# EAGLE design Otemba (EAGLE 5.11)
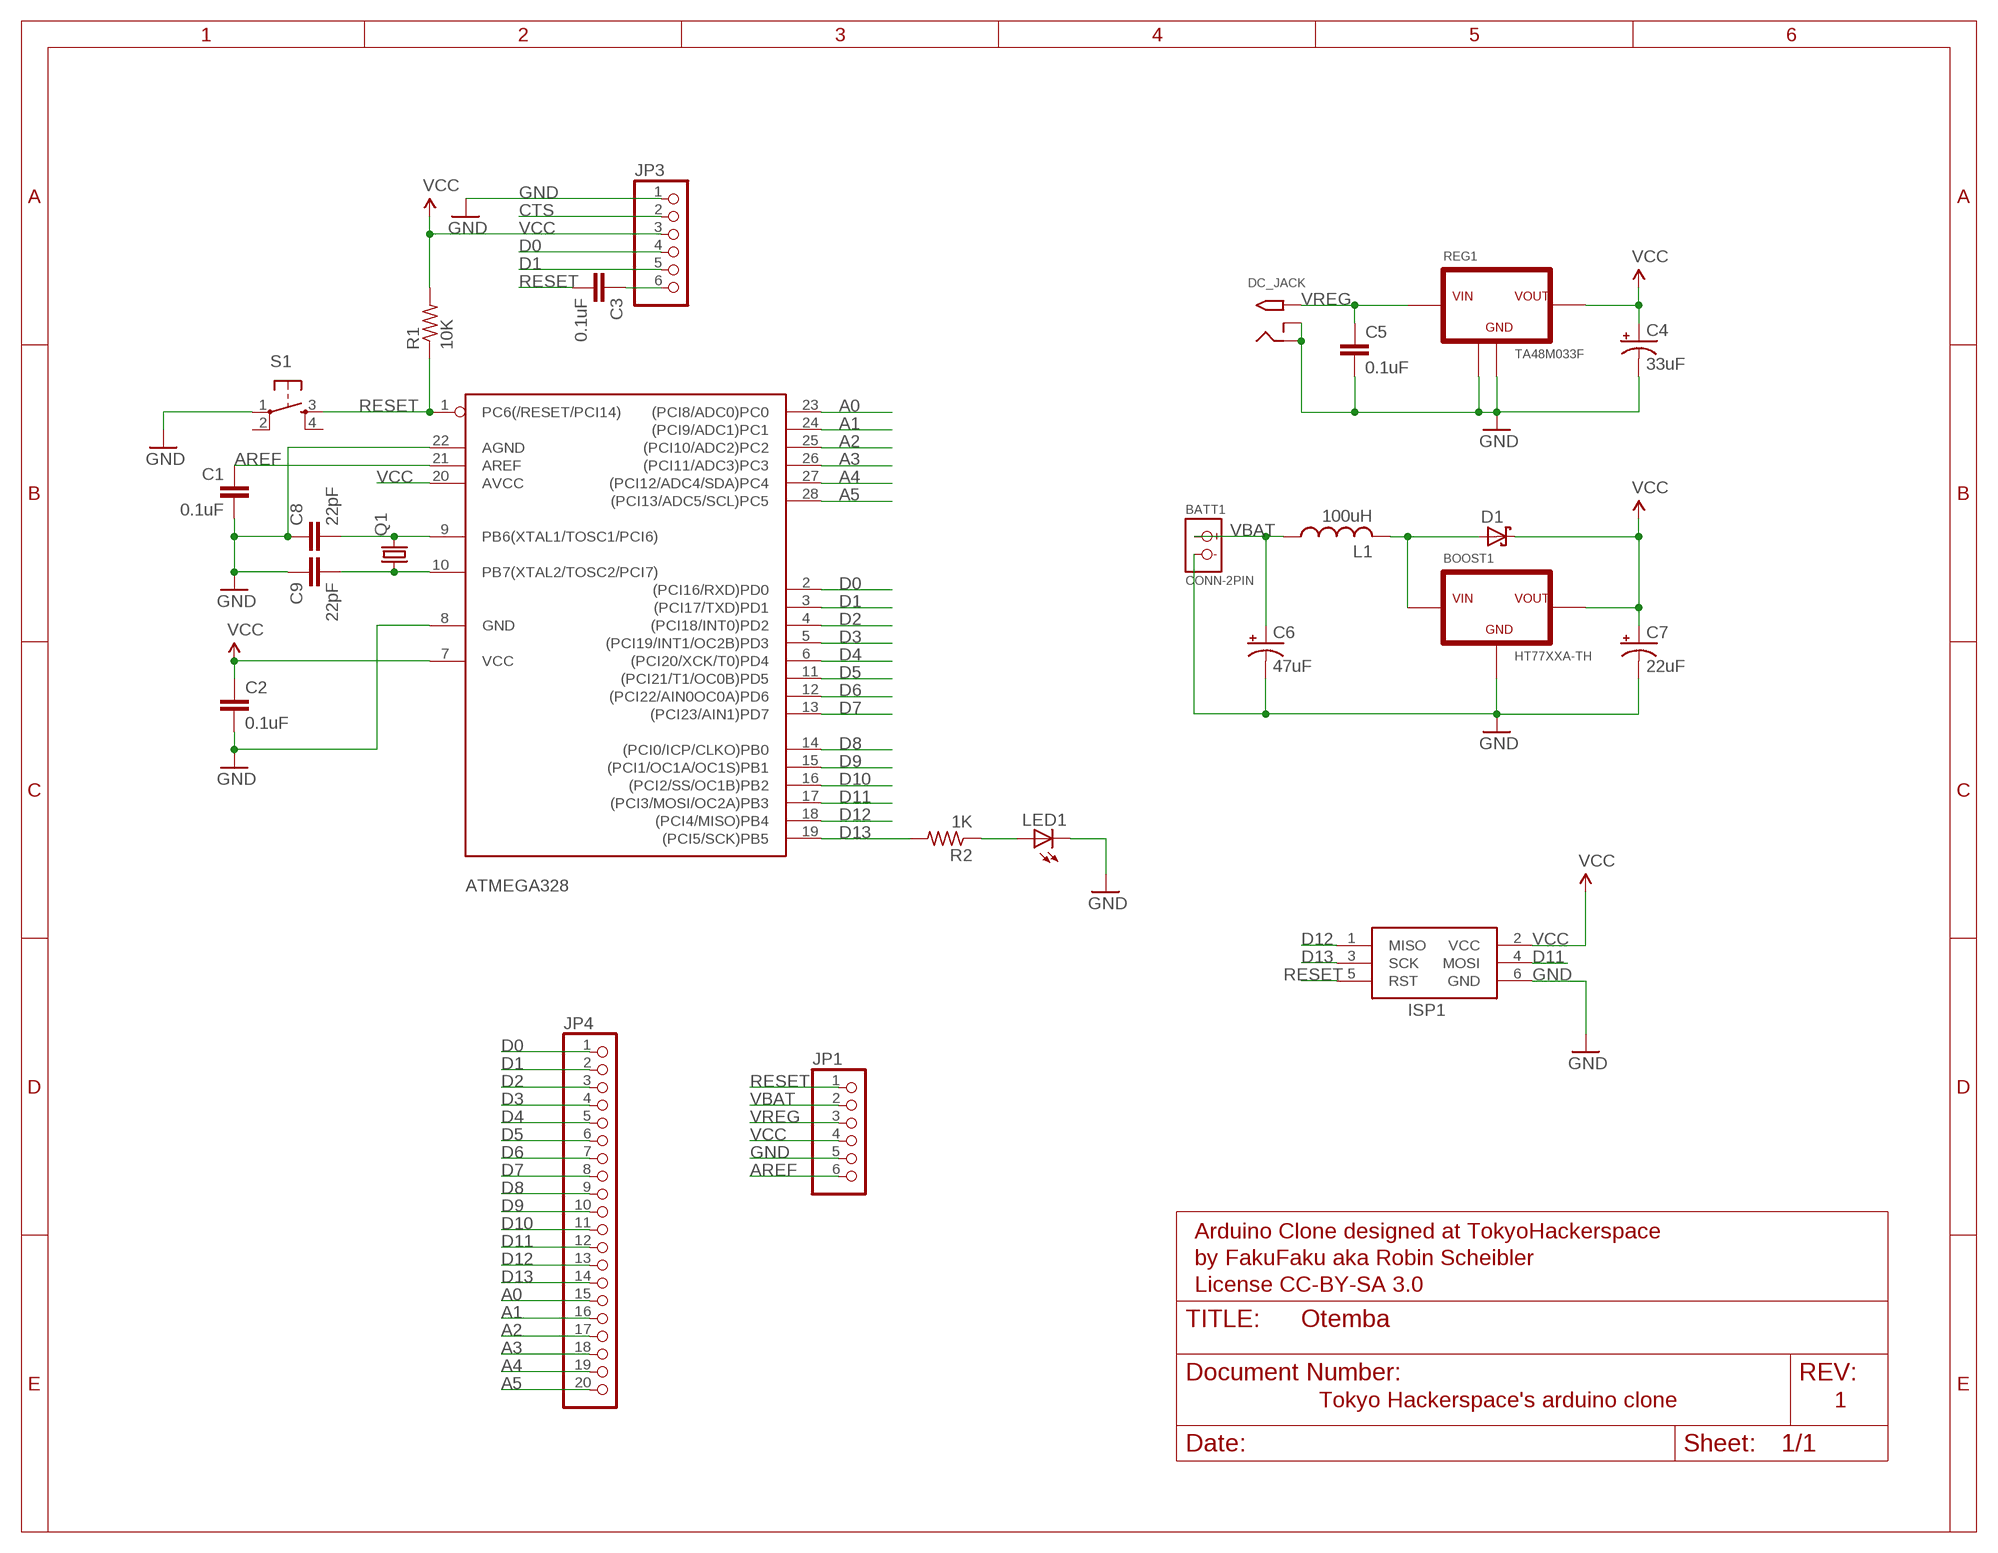
[diagram p0: schematic, sheet 1]

## Parts
ATMEGA328  ATMEGA168-20P  [DIL28-3]
BATT1  CONN-2PIN  [JST-XH2P]
BOOST1  HT77XXA-TH  [TO92-]
C1  0.1uF  CAPPTH  [CAP-PTH-SMALL]
C2  0.1uF  CAPPTH  [CAP-PTH-SMALL]
C3  0.1uF  CAPPTH  [CAP-PTH-SMALL]
C4  33uF  CPOL-USE2-5  [E2-5]
C5  0.1uF  CAPPTH  [CAP-PTH-SMALL]
C6  47uF  CPOL-USE2-5  [E2-5]
C7  22uF  CPOL-USE2-5  [E2-5]
C8  22pF  CAPPTH  [CAP-PTH-SMALL]
C9  22pF  CAPPTH  [CAP-PTH-SMALL]
D1  SCHOTTKY-DIODEDO41-7  [DO41-7]
DC_JACK  2.1MMJACKTHM  [PJ-102A]
ISP1  AVRISP-6  [AVRISP]
JP1  PINHD-1X6  [1X06]
JP3  PINHD-1X6/90  [1X06/90]
JP4  PINHD-1X20  [1X20]
L1  100uH  L-US0207/10  [0207/10]
LED1  LED3MM  [LED3MM]
Q1  CRYSTALHC49S  [HC49/S]
R1  10K  R-US_0207/10  [0207/10]
R2  1K  R-US_0207/10  [0207/10]
REG1  TA48M033F  REGULATOR  [HSIP3-P-2.30B]
S1  TAC_SWITCHPTH  [TACTILE-PTH]

## Nets
A0: ATMEGA328.23((PCI8/ADC0)PC0) JP4.15
A1: ATMEGA328.24((PCI9/ADC1)PC1) JP4.16
A2: ATMEGA328.25((PCI10/ADC2)PC2) JP4.17
A3: ATMEGA328.26((PCI11/ADC3)PC3) JP4.18
A4: ATMEGA328.27((PCI12/ADC4/SDA)PC4) JP4.19
A5: ATMEGA328.28((PCI13/ADC5/SCL)PC5) JP4.20
AREF: ATMEGA328.21(AREF) C1.1 JP1.6
CTS: JP3.2
D0: ATMEGA328.2((PCI16/RXD)PD0) JP3.4 JP4.1
D1: ATMEGA328.3((PCI17/TXD)PD1) JP3.5 JP4.2
D2: ATMEGA328.4((PCI18/INT0)PD2) JP4.3
D3: ATMEGA328.5((PCI19/INT1/OC2B)PD3) JP4.4
D4: ATMEGA328.6((PCI20/XCK/T0)PD4) JP4.5
D5: ATMEGA328.11((PCI21/T1/OC0B)PD5) JP4.6
D6: ATMEGA328.12((PCI22/AIN0OC0A)PD6) JP4.7
D7: ATMEGA328.13((PCI23/AIN1)PD7) JP4.8
D8: ATMEGA328.14((PCI0/ICP/CLKO)PB0) JP4.9
D9: ATMEGA328.15((PCI1/OC1A/OC1S)PB1) JP4.10
D10: ATMEGA328.16((PCI2/SS/OC1B)PB2) JP4.11
D11: ATMEGA328.17((PCI3/MOSI/OC2A)PB3) ISP1.4(MOSI) JP4.12
D12: ATMEGA328.18((PCI4/MISO)PB4) ISP1.1(MISO) JP4.13
D13: ATMEGA328.19((PCI5/SCK)PB5) ISP1.3(SCK) JP4.14 R2.2
GND: ATMEGA328.8(GND) ATMEGA328.22(AGND) BATT1.M BOOST1.3(GND) C1.2 C2.2 C4.- C5.2 C6.- C7.- C8.1 C9.1 DC_JACK.RING DC_JACK.RING_SW ISP1.6(GND) JP1.5 JP3.1 LED1.K(C) REG1.2(GND) REG1.HEATSINK(GND) S1.1
N$1: ATMEGA328.9(PB6(XTAL1/TOSC1/PCI6)) C8.2 Q1.2
N$2: ATMEGA328.10(PB7(XTAL2/TOSC2/PCI7)) C9.2 Q1.1
N$4: BOOST1.1(VIN) D1.A L1.2
N$5: LED1.A R2.1
N$7: C3.1 JP3.6
RESET: ATMEGA328.1(PC6(/RESET/PCI14)) C3.2 ISP1.5(RST) JP1.1 R1.1 S1.3
VBAT: BATT1.P C6.+ JP1.2 L1.1
VCC: ATMEGA328.7(VCC) ATMEGA328.20(AVCC) BOOST1.2(VOUT) C2.1 C4.+ C7.+ D1.C ISP1.2(VCC) JP1.4 JP3.3 R1.2 REG1.3(VOUT)
VREG: C5.1 DC_JACK.TIP JP1.3 REG1.1(VIN)
Unconnected: S1.2 S1.4

## Notes on the sheet
- Arduino Clone designed at TokyoHackerspace
- by FakuFaku aka Robin Scheibler
- License CC-BY-SA 3.0
- Tokyo Hackerspace's arduino clone | 1

## Library data of the parts
ATMEGA328 = adafruit:ATMEGA168*P: MICROCONTROLLER 16 kBytes FLASH 1 kBytes SRAM 512 Bytes EEPROM USART 8-channel 10 bit ADC
BATT1 = Robin:CONN-2PIN
BOOST1 = Robin:HT77XXA-TH
C1-C3 C5 C8 C9 = SparkFun:CAP: Capacitor Standard 0603 ceramic capacitor, and 0.1" leaded capacitor.
C4 C6 C7 = adafruit:CPOL-US: POLARIZED CAPACITOR, American symbol
D1 = adafruit:SCHOTTKY-DIODE: Schottky Diode
DC_JACK = adafruit:2.1MMJACK: 2.1mm x 5.5mm THM DC jack with internal switch. Digikey part #PJ-102A, 4UCON part #05537 2.1mm x 5.5mm SMT DC jack with internal switch. Digikey part #PJ-002A-SMT, 4UCON part #03267 By microbuilder.eu & adafruit.com
ISP1 = adafruit:AVRISP: AVR ISP HEADER Standard 6 pin header for AVR programming
JP1 JP3 = pinhead:PINHD-1X6: PIN HEADER
JP4 = Robin:PINHD-1X20: PIN HEADER
L1 = rcl:L-US: INDUCTOR, American symbol
LED1 = adafruit:LED: LED OSRAM: - CHIPLED LG R971, LG N971, LY N971, LG Q971, LY Q971, LO R971, LY R971 LH N974, LH R974 LS Q976, LO Q976, LY Q976 LO Q996 - Hyper CHIPLED LW Q18S LB Q993, LB Q99A, LB R99A - SideLED LS A670, LO A670, LY A670, LG A670, LP A670 LB A673, LV A673, LT A673, LW A673 LH A674 LY A675 LS A676, LA A676, LO A676, LY A676, LW A676 LS A679, LY A679, LG A679 - Hyper Micro SIDELED® LS Y876, LA Y876, LO Y876, LY Y876 LT Y87S - SmartLED LW L88C, LW L88S LB L89C, LB L89S, LG L890 LS L89K, LO L89K, LY L89K LS L896, LA L896, LO L896, LY L896 - TOPLED LS T670, LO T670, LY T670, LG T670, LP T670 LSG T670, LSP T670, LSY T670, LOP T670, LYG T670 LG T671, LOG T671, LSG T671 LB T673, LV T673, LT T673, LW T673 LH T674 LS T676, LA T676, LO T676, LY T676, LB T676, LH T676, LSB T676, LW T676 LB T67C, LV T67C, LT T67C, LS T67K, LO T67K, LY T67K, LW E67C LS E67B, LA E67B, LO E67B, LY E67B, LB E67C, LV E67C, LT E67C LW T67C LS T679, LY T679, LG T679 LS T770, LO T770, LY T770, LG T770, LP T770 LB T773, LV T773, LT T773, LW T773 LH T774 LS E675, LA E675, LY E675, LS T675 LS T776, LA T776, LO T776, LY T776, LB T776 LHGB T686 LT T68C, LB T68C - Hyper Mini TOPLED® LB M676 - Mini TOPLED Santana® LG M470 LS M47K, LO M47K, LY M47K Source: http://www.osram.convergy.de/
Q1 = crystal:CRYSTAL: CRYSTAL; OC_FARNELL: 1667008; OC_NEWARK: unknown
R1 R2 = adafruit:R-US_: RESISTOR, American symbol
REG1 = Robin:REGULATOR
S1 = SparkFun:TAC_SWITCH: Momentary Switch Button commonly used for reset or general input. Spark Fun Electronics SKU : COM-00097

## Board
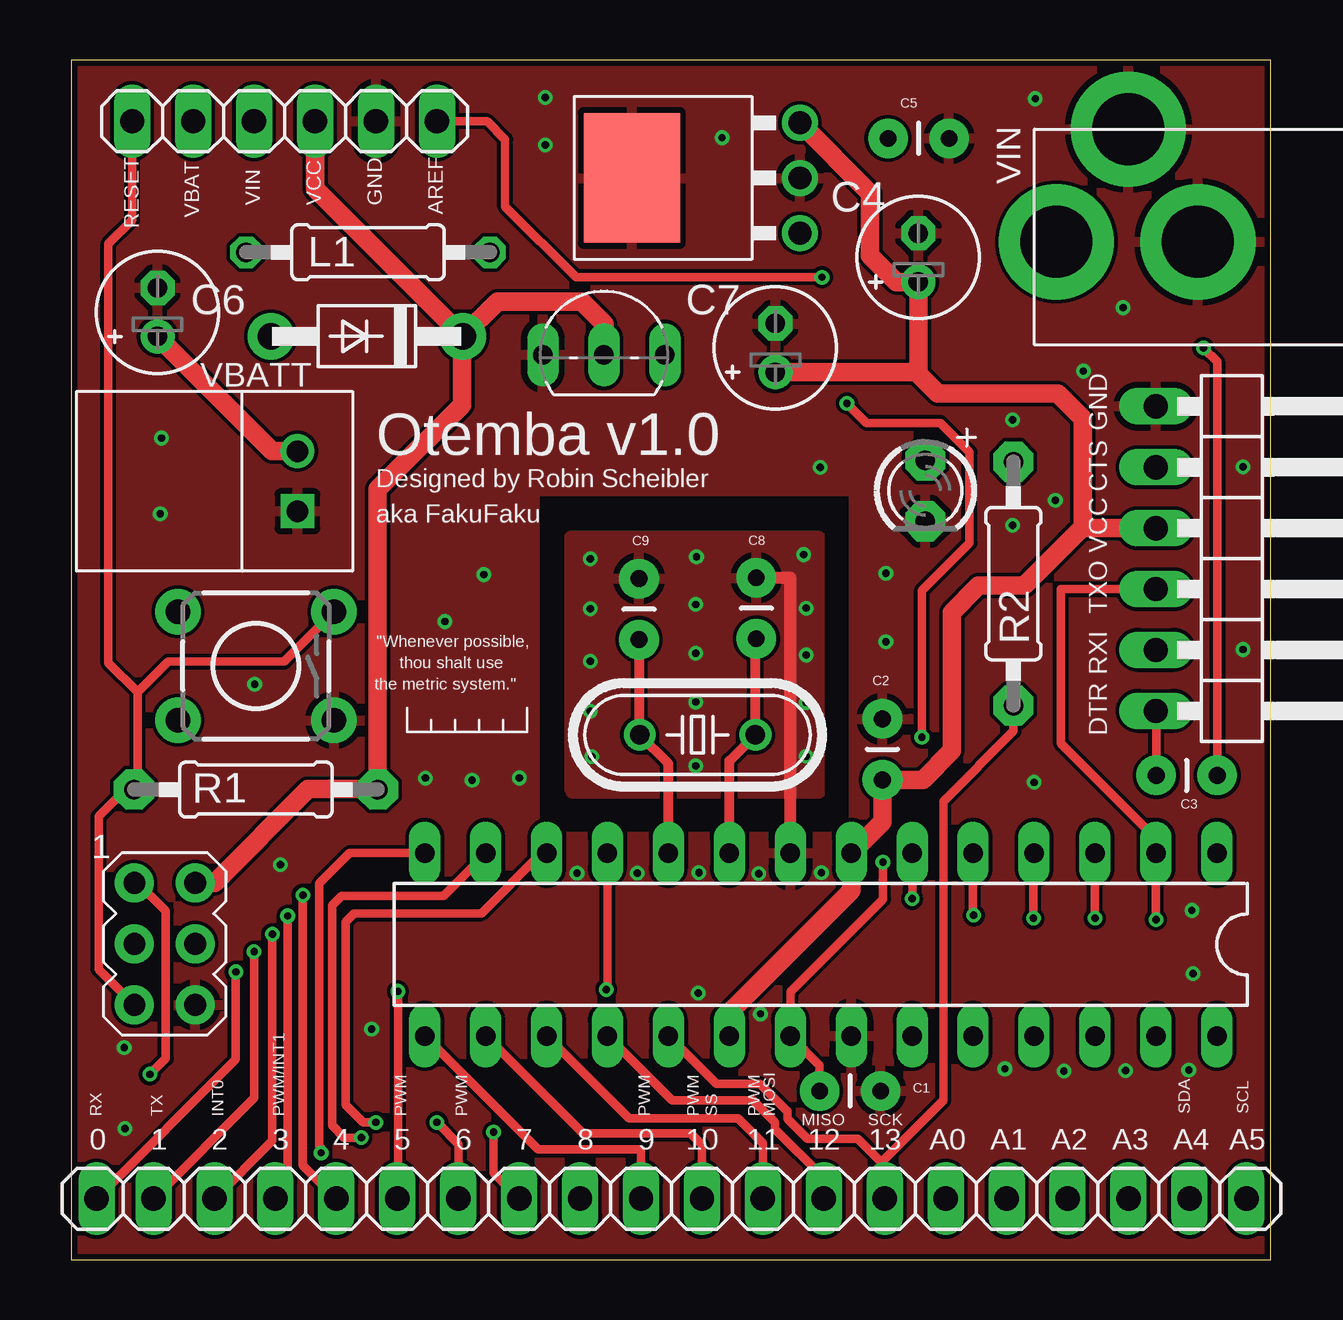
[diagram p1: board, top side]
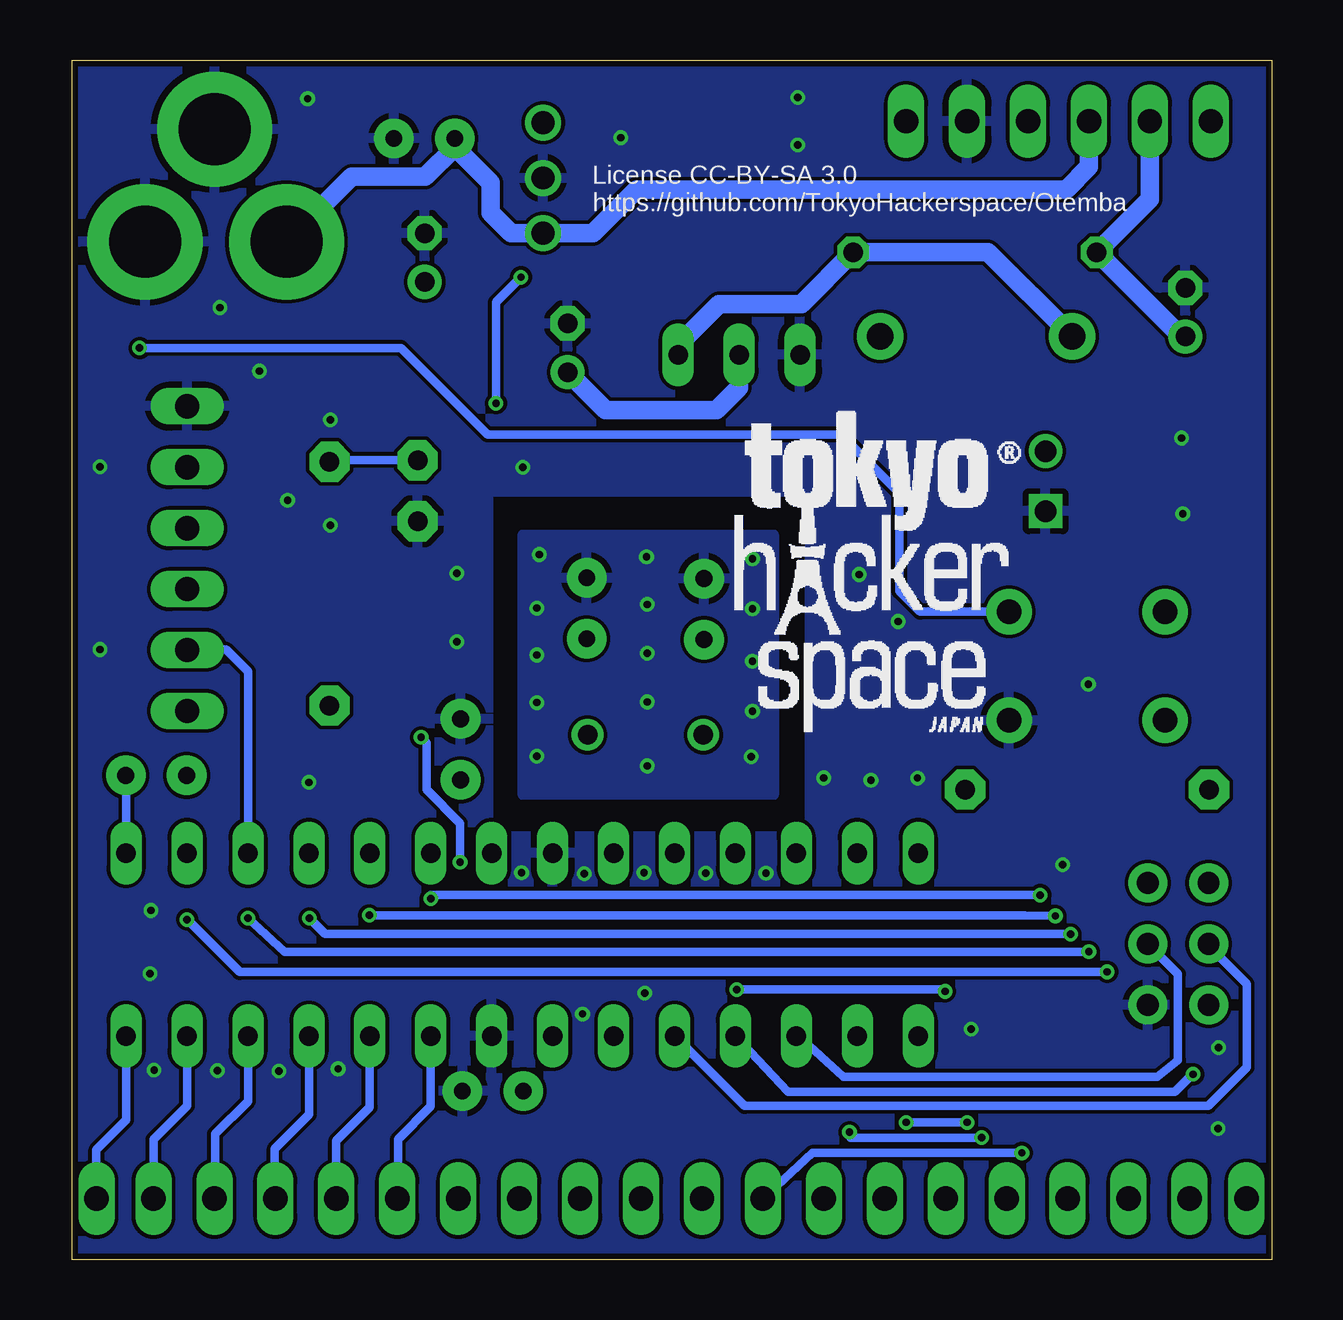
[diagram p2: board, bottom side, seen from below]

Size 50 x 50 mm. Coordinates in mm from the lower left corner, seen from the top.
Outline: 0,0 50,0 50,50 0,50 0,0
Copper layers (1*16): Top 0.035mm / dielectric 1.5mm / Bottom 0.035mm
Design rules "Fusion_eagle_rule_v1.1": minimum track width 6mil, minimum drill 12mil, track to track 6mil, track to pad 6mil, pad to pad 6mil, via to via 6mil, smd to smd 0mil, copper to edge 10mil, drill to drill 10mil, minimum pad ring 10mil, minimum via ring 6mil, stop-mask expansion 2mil, vias tented up to drill 100mil, thermal gap 10mil

### Footprints (pad centres in the part's own frame; a part is rotated, then mirrored left to right if it is on the bottom)
DIL28-3 = drill 0.813 long: 1 -16.51,-3.81; 2 -13.97,-3.81; 3 -11.43,-3.81; 4 -8.89,-3.81; 5 -6.35,-3.81; 6 -3.81,-3.81; 7 -1.27,-3.81; 8 1.27,-3.81; 9 3.81,-3.81; 10 6.35,-3.81; 11 8.89,-3.81; 12 11.43,-3.81; 13 13.97,-3.81; 14 16.51,-3.81; 15 16.51,3.81; 16 13.97,3.81; 17 11.43,3.81; 18 8.89,3.81; 19 6.35,3.81; 20 3.81,3.81; 21 1.27,3.81; 22 -1.27,3.81; 23 -3.81,3.81; 24 -6.35,3.81; 25 -8.89,3.81; 26 -11.43,3.81; 27 -13.97,3.81; 28 -16.51,3.81
JST-XH2P = drill 0.9 square: M 0,0 | drill 0.9 round: P 2.5,0
TO92- = drill 0.813 long: 1 2.54,0; 2 0,0; 3 -2.54,0
CAP-PTH-SMALL = drill 0.7 pad 1.651 round: 1 0,0; 2 2.54,0
E2-5 = drill 0.813 pad 1.422 round: + -1.016,0 | drill 0.813 pad 1.422 octagon: - 1.016,0
DO41-7 = drill 1.118 pad 1.93 round: A 4,0; C -4,0
PJ-102A = drill 3 pad 4.8 round: RING 0.1,-3.39; RING_SW -4.6,-6.29; TIP 0.1,-9.29
AVRISP = drill 0.9 pad 1.626 round: 1 -1.27,2.54; 2 1.27,2.54; 3 -1.27,0; 4 1.27,0; 5 -1.27,-2.54; 6 1.27,-2.54
1X06 = drill 1.016 long: 1 -6.35,0; 2 -3.81,0; 3 -1.27,0; 4 1.27,0; 5 3.81,0; 6 6.35,0
1X06/90 = drill 1.016 long: 1 -6.35,-3.81; 2 -3.81,-3.81; 3 -1.27,-3.81; 4 1.27,-3.81; 5 3.81,-3.81; 6 6.35,-3.81
1X20 = drill 1.016 pad 1.016 long: 1 -23.965,0; 20 23.965,0 | drill 1.016 long: 2 -21.59,0; 3 -19.05,0; 4 -16.51,0; 5 -13.97,0; 6 -11.43,0; 7 -8.89,0; 8 -6.35,0; 9 -3.81,0; 10 -1.27,0; 11 1.27,0; 12 3.81,0; 13 6.35,0; 14 8.89,0; 15 11.43,0; 16 13.97,0; 17 16.51,0; 18 19.05,0; 19 21.59,0
0207/10 = drill 0.813 octagon: 1 -5.08,0; 2 5.08,0
LED3MM = drill 0.813 pad 1.676 octagon: A -1.27,0; K 1.27,0
HC49/S = drill 0.813 round: 1 -2.413,0; 2 2.413,0
0207/10' = drill 0.813 pad 1.676 octagon: 1 -5.08,0; 2 5.08,0
HSIP3-P-2.30B = drill 0.95 pad 1.5 round: 1 -2.3,0; 2 0,0; 3 2.3,0 | smd 5.4 x 4: HEATSINK 0,7
TACTILE-PTH = drill 1.016 pad 1.88 round: 1 -3.251,2.261; 2 3.251,2.261; 3 -3.251,-2.261; 4 3.251,-2.261

### Placement (x,y rotation side)
ATMEGA328  31.24,13.13 180 top
BATT1  9.43,31.19 90 top
BOOST1  22.2,37.71 0 top
C1  31.2,7.02 0 top
C2  33.81,19.99 90 top
C3  45.23,20.18 0 top
C4  35.31,41.76 90 top
C5  34.05,46.73 0 top
C6  3.6,39.49 90 top
C7  29.35,38 90 top
C8  28.55,28.42 270 top
C9  23.66,28.38 270 top
D1  12.32,38.48 180 top
DC_JACK  50.35,42.52 270 top
ISP1  3.9,13.16 0 top
JP1  8.89,47.45 0 top
JP3  49.02,29.22 270 top
JP4  25.02,2.54 0 top
L1  12.37,41.98 0 top
LED1  35.6,32.04 270 top
Q1  26.1,21.87 0 top
R1  10K  [0207/10']  7.7,19.59 0 top
R2  1K  [0207/10']  39.27,28.17 270 top
REG1  30.37,45.08 90 top
S1  7.7,24.74 180 top
U$1  [THS]  26.31,19.05 0 bottom

### Tracks (layer width: path | path; a pad name or v marks a point on that pad's centre or on a via)
A0
  Bottom 0.356: ATMEGA328.23 35.05,6.38 36.42,5 36.42,2.56 JP4.15
A1
  Bottom 0.356: ATMEGA328.24 37.59,6.35 38.99,4.95 JP4.16
A2
  Bottom 0.356: ATMEGA328.25 40.13,6.04 41.55,4.62 41.55,2.56 JP4.17
A3
  Bottom 0.356: ATMEGA328.26 42.67,6.6 44.04,5.23 44.04,2.56 JP4.18
A4
  Bottom 0.356: ATMEGA328.27 45.21,6.4 46.61,5 JP4.19
A5
  Bottom 0.356: ATMEGA328.28 47.75,5.82 49,4.57 49,2.55 JP4.20
AREF  (via drill 0.3)
  Top 0.356: v33.83,16.56 33.83,15.01 29.97,11.15 ATMEGA328.21 31.2,8.1 C1.1 | v35.46,21.77 35.46,27.89 37.44,29.87 37.44,33.66 36.22,34.87 33.15,34.87 v32.33,35.69 | v31.29,40.95 21.03,40.95 18.09,43.89 18.09,46.69 17.32,47.45 JP1.6
  Bottom 0.356: v33.83,16.56 33.83,18.19 35.23,19.58 35.23,21.54 v35.46,21.77 | v32.33,35.69 32.33,39.9 v31.29,40.95
D0  (via drill 0.3)
  Top 0.356: v45.21,14.17 ATMEGA328.2 45.21,17.55 41.25,21.51 41.25,27.94 JP3.4 | v6.86,11.99 6.86,8.34 JP4.1
  Bottom 0.356: v6.86,11.99 43.03,11.99 v45.21,14.17
D1  (via drill 0.3)
  Top 0.356: v42.67,14.22 ATMEGA328.3 | v7.62,12.83 7.62,6.73 JP4.2
  Bottom 0.356: v7.62,12.83 41.15,12.83 v42.67,14.22 | ATMEGA328.3 42.67,24.51 43.59,25.43 45.19,25.43 JP3.5
D2  (via drill 0.3)
  Top 0.356: v40.11,14.22 40.11,16.92 ATMEGA328.4 | v8.38,13.56 8.38,4.95 JP4.3
  Bottom 0.356: v8.38,13.56 39.45,13.56 v40.11,14.22
D3  (via drill 0.3)
  Top 0.356: v37.62,14.35 37.59,14.25 ATMEGA328.5 | v9.02,14.33 9.02,3.05 JP4.4
  Bottom 0.356: v9.02,14.33 10.29,14.35 v37.62,14.35
D4  (via drill 0.3)
  Top 0.356: 11.15,2.64 JP4.5 9.65,3.94 v9.65,15.19 | v35.05,15.04 ATMEGA328.6
  Bottom 0.356: v9.65,15.19 35.05,15.19 v35.05,15.04
D5  (via drill 0.3)
  Top 0.356: ATMEGA328.11 22.35,11.3 v22.3,11.25 | v13.61,11.18 13.61,2.56 JP4.6
  Bottom 0.356: v22.3,11.25 13.69,11.25 v13.61,11.18
D6  (via drill 0.3)
  Top 0.356: ATMEGA328.12 19.61,16.94 17.09,14.43 11.79,14.43 11.43,14.07 11.43,6.45 12.17,5.71 v12.7,5.71 | JP4.7 16.15,2.56 16.15,4.8 v15.24,5.71
  Bottom 0.356: v12.7,5.71 v15.24,5.71
D7  (via drill 0.3)
  Top 0.356: ATMEGA328.13 17.27,16.92 15.52,15.16 11.28,15.16 10.87,14.76 10.87,5.59 11.38,5.08 v12.09,5.08 | v17.6,5.31 17.6,3.61 JP4.8
  Bottom 0.356: v12.09,5.08 17.55,5.08 v17.6,5.31
D8  (via drill 0.3)
  Top 0.356: ATMEGA328.14 11.61,16.94 10.34,15.67 10.34,4.72 10.41,4.65 v10.41,4.45
  Bottom 0.356: v10.41,4.45 19.15,4.45 JP4.9
D9
  Top 0.356: ATMEGA328.15 19.46,4.6 23.75,4.6 JP4.10
D10
  Top 0.356: ATMEGA328.16 21.34,5.26 25.81,5.26 26.29,4.78 JP4.11
D11
  Top 0.356: ATMEGA328.17 23.24,5.89 27.79,5.89 28.83,4.85 JP4.12
  Bottom 0.356: ATMEGA328.17 19.74,9.32 17.86,7.62 4.78,7.62 3.91,8.31 3.91,11.9 ISP1.4
D12  (via drill 0.3)
  Top 0.356: ATMEGA328.18 25.04,6.63 28.42,6.63 29.34,5.71 29.34,5.44 31.37,3.4 JP4.13 | v3.28,7.72 3.94,8.38 3.94,14.53 2.77,15.7 ISP1.1
  Bottom 0.356: ATMEGA328.18 20.17,6.99 4.04,6.99 3.3,7.72 v3.28,7.72
D13
  Top 0.356: ATMEGA328.19 26.9,7.32 28.7,7.32 29.84,6.17 29.84,5.87 30.68,5.03 32.79,5.03 33.77,4.05 | 33.77,4.05 33.91,3.91 JP4.14 | R2.2 39.27,22.02 36.35,19.1 36.35,6.63 33.77,4.05
  Bottom 0.356: ATMEGA328.19 21.97,6.4 2.64,6.4 1.04,8 1.04,11.48 2.63,13.07 ISP1.3
GND  (via drill 0.3)
  Top 0.508: C8.1 29.97,28.42 ATMEGA328.8
  other vias: 21.64,29.21 21.64,27.13 21.64,24.94 21.64,22.86 21.69,20.95 26.06,29.29 26.04,27.3 26.04,25.27 26.04,23.24 26.04,20.57 30.53,29.39 30.63,27.15 30.63,25.2 30.63,23.22 30.63,20.98 39.24,35 41.02,31.65 39.24,30.61 40.13,19.89 46.71,14.55 46.76,11.91 46.58,7.9 43.94,7.87 41.38,7.85 38.91,7.95 28.73,10.24 26.14,11.1 26.16,16.13 23.6,16.1 21.08,16.1 28.65,16.08 31.27,16.13 14.77,20.07 18.68,20.07 8.71,16.46 7.65,23.98 3.71,31.09 3.76,34.24 17.2,28.55 15.57,26.59 31.22,33.02 33.96,28.6 33.96,25.76 19.76,48.44 19.76,46.46 27.13,46.76 40.18,48.39 43.84,39.67 42.19,37.03 48.84,33.05 48.84,25.43 12.52,9.6 2.21,8.84 2.24,5.46 16.71,19.98
  pour Bottom: 20.75,19.35 31.22,19.35 31.22,30.23 20.75,30.23 20.75,19.43
  pour Top: 20.83,19.43 31.22,19.43 31.22,30.15 20.75,30.15 20.75,19.58
  pour Top: 19.3,52.35 19.3,17.63 32.61,17.63 32.61,32 19.38,32 19.38,52.35 53.01,52.35 53.01,-2.59 -3.33,-2.59 -3.33,52.35
  pour Bottom: -4.42,51.08 19.28,51.08 19.28,17.63 32.64,17.63 32.64,32 19.56,32 19.56,50.98 62.38,50.98 62.38,-1.5 -12.8,-1.5 -12.8,50.8 -4.42,50.8
N$1
  Top 0.406: ATMEGA328.9 27.43,20.78 Q1.2 28.52,25.84 C8.2
N$2
  Top 0.406: ATMEGA328.10 24.89,20.67 Q1.1 23.69,25.81 C9.2
N$4
  Bottom 0.762: D1.A 11.82,41.98 L1.2 19.61,39.83 23.04,39.83 24.74,38.12 BOOST1.1
N$5
  Bottom 0.356: LED1.A 39.21,33.31 R2.1
N$7
  Top 0.356: C3.1 45.23,22.85 JP3.6
RESET  (via drill 0.3)
  Top 0.356: ISP1.5 1.14,12.1 1.14,18.47 2.27,19.59 R1.1 2.76,19.74 2.77,19.74 2.77,23.65 | 2.77,23.65 4.04,24.92 8.87,24.92 S1.3 | JP1.1 2.54,43.33 1.55,42.34 1.55,24.87 2.77,23.65 | C3.2 47.77,37.43 v47.19,38
  Bottom 0.356: v47.19,38 36.3,38 32.69,34.39 17.96,34.39 15.52,31.95 15.52,27.86 14.66,27 S1.3 | ATMEGA328.1 47.75,20.17 C3.2
VBAT
  Top 0.762: BATT1.P 8.37,33.69 C6.+
  Bottom 0.762: C6.+ 3.77,38.47 L1.1 5.08,44.2 JP1.2
VCC
  Top 0.762: REG1.3 33.3,44.45 33.3,41.83 34.38,40.75 C4.+ 35.31,37.06 35.28,37.03 | D1.C 17.76,39.93 21.29,39.93 22.23,38.99 22.2,38.97 BOOST1.2 | ATMEGA328.20 27.43,10.31 32.51,15.39 ATMEGA328.7 33.81,18.24 C2.1 35.49,20 36.7,21.21 36.7,26.98 37.82,28.09 39.73,28.09 42.16,30.53 | 42.16,30.53 42.16,35.05 41.12,36.09 36.12,36.09 35.28,36.93 35.28,37.03 | C7.+ 35.23,36.99 35.28,37.03 | JP3.3 42.21,30.49 42.16,30.53 | D1.C 16.28,38.45 16.28,35.61 12.78,32.11 R1.2 12.76,19.61 9.88,19.61 5.97,15.7 ISP1.2 | JP1.4 10.16,44.64 D1.C
  Bottom 0.762: C7.+ 27.77,35.41 23.14,35.41 22.2,36.34 BOOST1.2
VREG
  Bottom 0.762: 34.05,46.37 C5.1 | 34.05,46.37 35.28,45.14 38.35,45.14 DC_JACK.TIP | 34.05,46.37 32.56,44.88 32.56,43.64 31.71,42.78 REG1.1 28.29,42.78 26.47,44.6 8.56,44.6 7.62,45.54 JP1.3

### Text on the board
tPlace: VIN | VIN | VCC | GND | AREF | RESET | VBAT | VBATT | GND | Otemba v1.0 | Designed by Robin Scheibler | CTS | aka FakuFaku | VCC | TXO | "Whenever possible, | thou shalt use | the metric system." | RXI | DTR | RX | TX | INT0 | PWM/INT1 | PWM | PWM | PWM | PWM | SS | PWM | MOSI | MISO | SCK | SDA | SCL | 0 | 1 | 2 | 3 | 4 | 5 | 6 | 7 | 8 | 9 | 10 | 11 | 12 | 13 | A0 | A1 | A2 | A3 | A4 | A5
bPlace: License CC-BY-SA 3.0 | https://github.com/TokyoHackerspace/Otemba